# Altium schematic sheet NB3000_chc_video.SchDoc
size A3
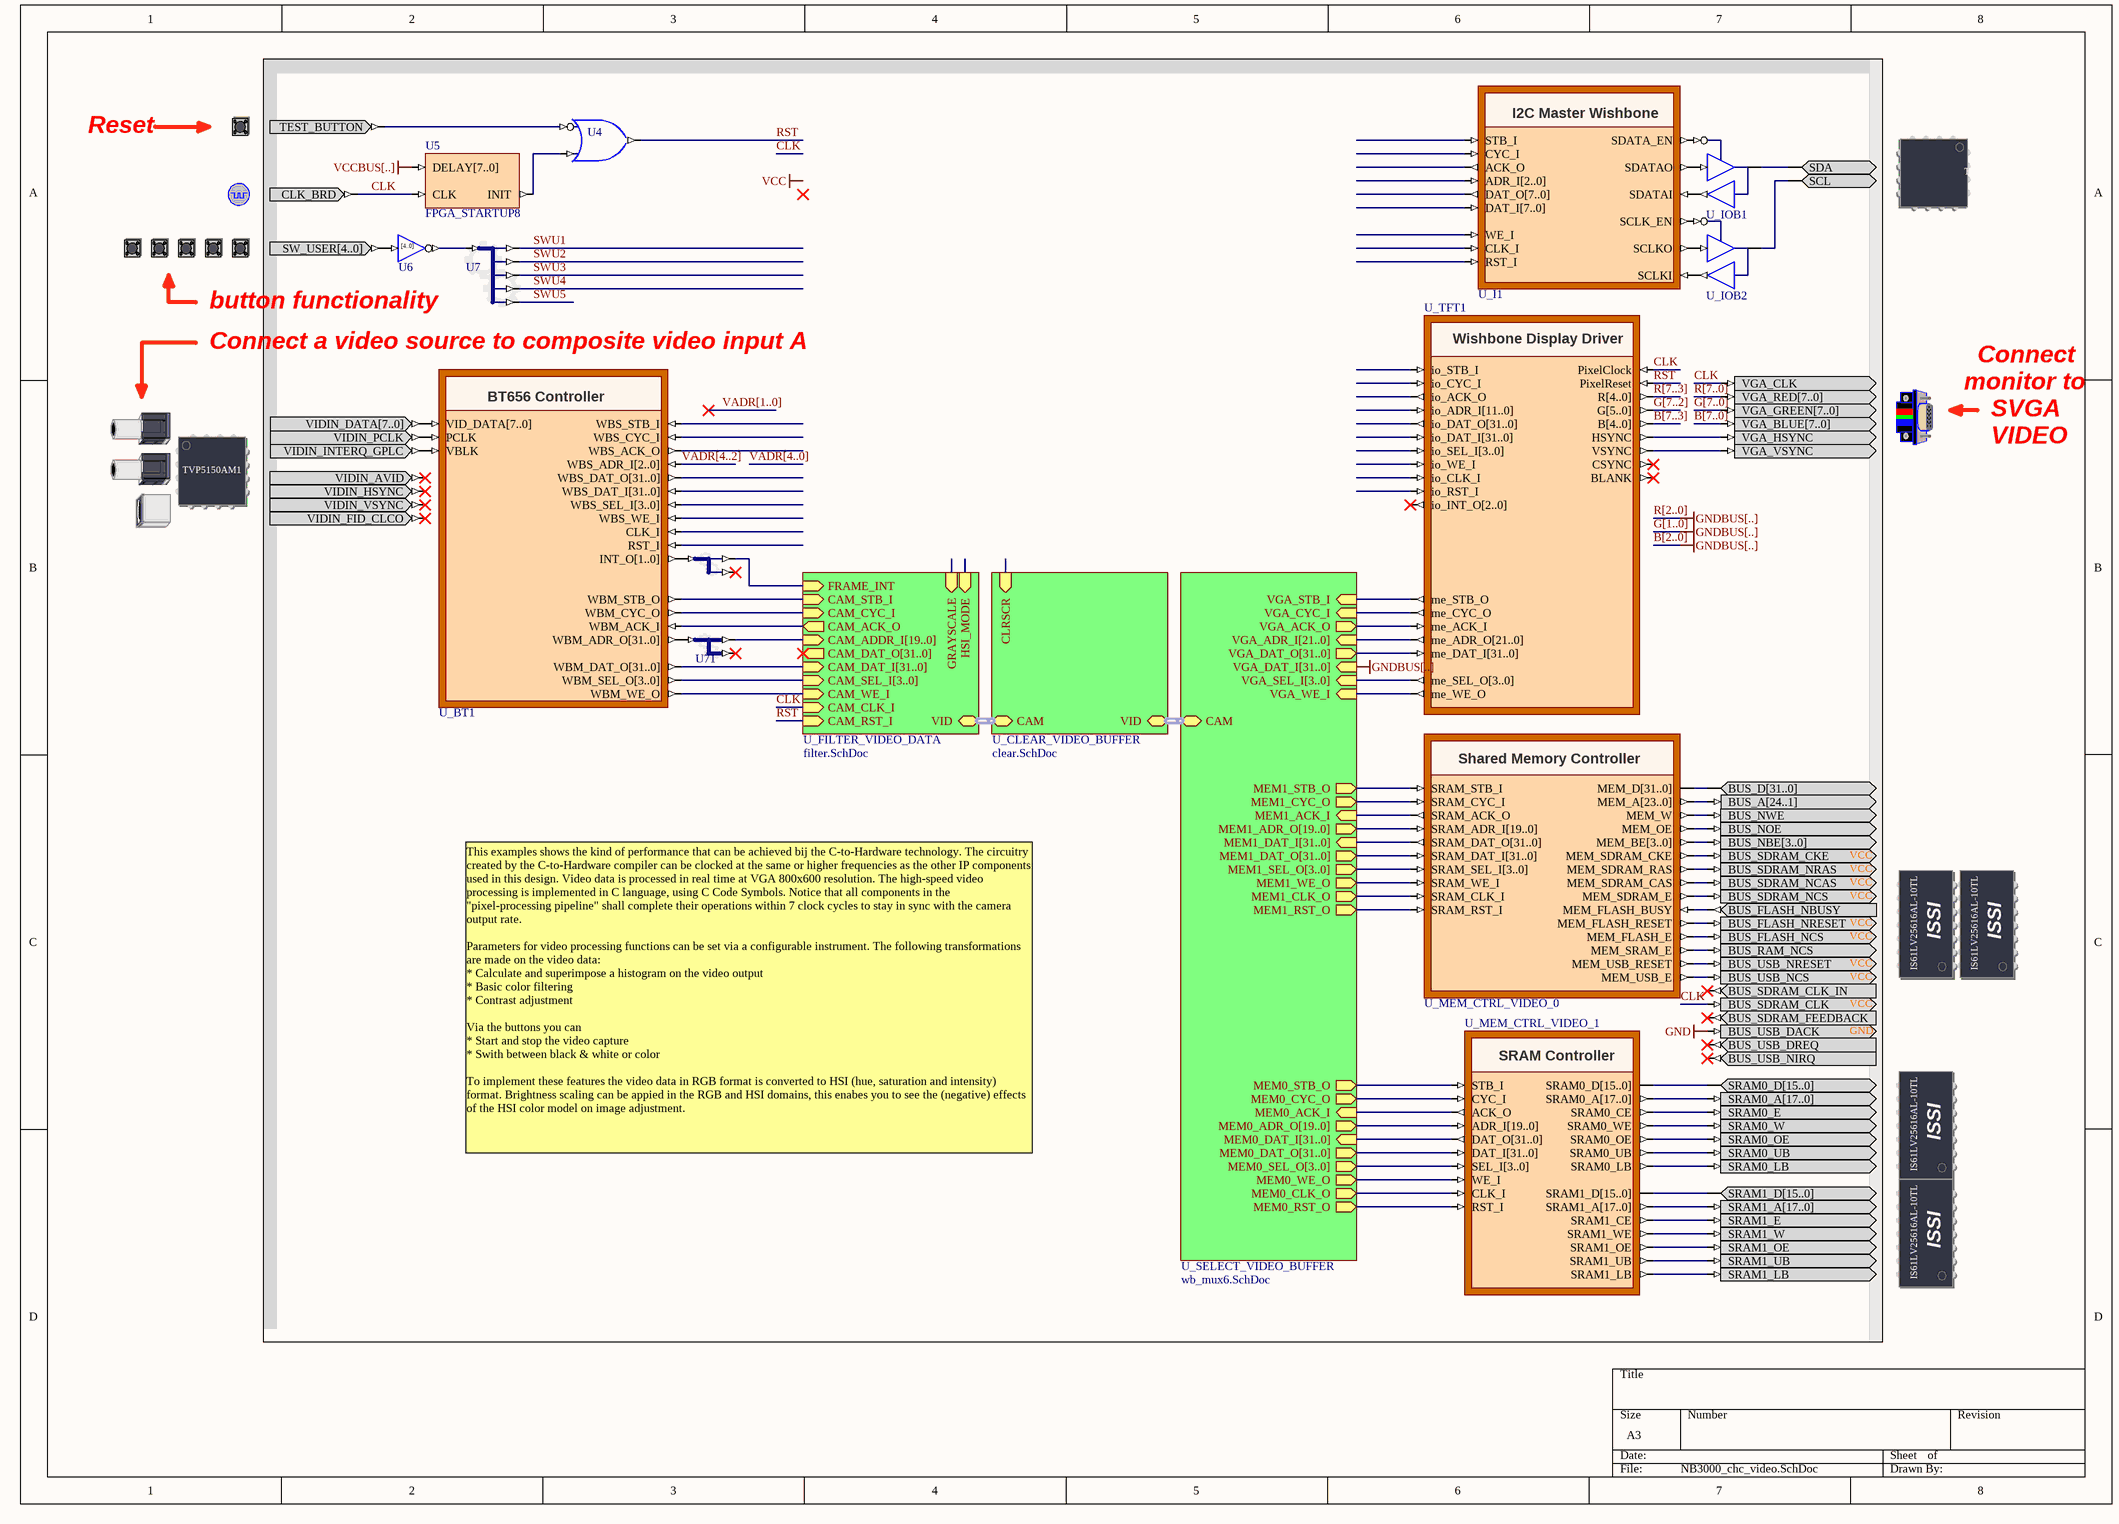
[diagram p0: NB3000_chc_video.SchDoc]

## Parts
(Parts that share a designator on the sheet are numbered #1, #2 ... from top to bottom, then left to right.)
?#1  TEST_BUTTON  (value not drawn)
?#2  VIDEO_INPUT_CTRL  (value not drawn)
?#3  CLOCK_BOARD  (value not drawn)
?#4  USER_BUTTONS  (value not drawn)
?#5  VGACNTR  (value not drawn)
?#6  VIDEO_INPUT  (value not drawn)
?#7  SHARED_SRAM  (value not drawn)
?#8  SRAM0  (value not drawn)
?#9  SRAM1  (value not drawn)
U4  OR2N1S  (value not drawn)
U5  FPGA_STARTUP8
U6  INV5B  (value not drawn)
U7  BUS_JS  (value not drawn)
U45  BUS_JS  (value not drawn)
U71  BUS_JS  (value not drawn)
U_BT1  BT656  (value not drawn)
U_I1  I2CM_W  (value not drawn)
U_IOB1  IOBUF  (value not drawn)
U_IOB2  IOBUF  (value not drawn)
U_MEM_CTRL_VIDEO_0  WB_SHARED_MEM_CTRL_NB3000  (value not drawn)
U_MEM_CTRL_VIDEO_1  WB_MEM_CTRL  (value not drawn)
U_TFT1  WB_VGA  (value not drawn)

## Sub-sheets
U_CLEAR_VIDEO_BUFFER = clear.SchDoc: CAM (harness H_WB), VID (harness H_WB), CLRSCR (in)
U_FILTER_VIDEO_DATA = filter.SchDoc: FRAME_INT (in), HSI_MODE (in), GRAYSCALE (in), CAM_CLK_I (in), CAM_RST_I (in), CAM_STB_I (in), CAM_CYC_I (in), CAM_ACK_O (out), CAM_ADDR_I[19..0] (in), CAM_DAT_I[31..0] (in), CAM_DAT_O[31..0] (out), CAM_SEL_I[3..0] (in), CAM_WE_I (in), VID (harness H_WB)
U_SELECT_VIDEO_BUFFER = wb_mux6.SchDoc: MEM1_STB_O (out), MEM1_CYC_O (out), MEM1_ACK_I (in), MEM1_ADR_O[19..0] (out), MEM1_DAT_I[31..0] (in), MEM1_DAT_O[31..0] (out), MEM1_SEL_O[3..0] (out), MEM1_WE_O (out), MEM1_CLK_O (out), MEM1_RST_O (out), MEM0_STB_O (out), MEM0_CYC_O (out), MEM0_ACK_I (in), MEM0_ADR_O[19..0] (out), MEM0_DAT_I[31..0] (in), MEM0_DAT_O[31..0] (out), MEM0_SEL_O[3..0] (out), MEM0_WE_O (out), MEM0_CLK_O (out), MEM0_RST_O (out), VGA_ADR_I[21..0] (in), VGA_CYC_I (in), VGA_STB_I (in), VGA_WE_I (in), VGA_DAT_I[31..0] (in), VGA_ACK_O (out), VGA_DAT_O[31..0] (out), VGA_SEL_I[3..0] (in), CAM (harness H_WB)

## Nets
GND: ?#7.BUS_USB_DACK
VCCBUS[..]: U5.DELAY[7..0]
B[7..0]: ?#5.VGA_BLUE[7..0]
B[7..3]: U_TFT1.B[4..0]
CLK: ?#3.CLK_BRD ?#5.VGA_CLK ?#7.BUS_SDRAM_CLK U5.CLK U_TFT1.PixelClock ; sheet U_FILTER_VIDEO_DATA/CAM_CLK_I
G[7..0]: ?#5.VGA_GREEN[7..0]
G[7..2]: U_TFT1.G[5..0]
R[7..0]: ?#5.VGA_RED[7..0]
R[7..3]: U_TFT1.R[4..0]
RST: U4.O U_TFT1.PixelReset ; sheet U_FILTER_VIDEO_DATA/CAM_RST_I
SWU1: U7.O0
SWU2: U7.O1
SWU3: U7.O2
SWU4: U7.O3
SWU5: U7.O4
VADR[4..2]: U_BT1.WBS_ADR_I[2..0]
Net?#1_TEST_BUTTON: ?#1.TEST_BUTTON U4.I0
Net?#2_SCL: ?#2.SCL U_IOB2.IO
Net?#2_SDA: ?#2.SDA U_IOB1.IO
Net?#4_SW_USER[4..0]: ?#4.SW_USER[4..0] U6.I[4..0]
Net?#5_VGA_HSYNC: ?#5.VGA_HSYNC U_TFT1.HSYNC
Net?#5_VGA_VSYNC: ?#5.VGA_VSYNC U_TFT1.VSYNC
Net?#6_VIDIN_DATA[7..0]: ?#6.VIDIN_DATA[7..0] U_BT1.VID_DATA[7..0]
Net?#6_VIDIN_INTERQ_GPLC: ?#6.VIDIN_INTERQ_GPLC U_BT1.VBLK
Net?#6_VIDIN_PCLK: ?#6.VIDIN_PCLK U_BT1.PCLK
Net?#7_BUS_A[24..1]: ?#7.BUS_A[24..1] U_MEM_CTRL_VIDEO_0.MEM_A[23..0]
Net?#7_BUS_D[31..0]: ?#7.BUS_D[31..0] U_MEM_CTRL_VIDEO_0.MEM_D[31..0]
Net?#7_BUS_FLASH_NBUSY: ?#7.BUS_FLASH_NBUSY U_MEM_CTRL_VIDEO_0.MEM_FLASH_BUSY
Net?#7_BUS_FLASH_NCS: ?#7.BUS_FLASH_NCS U_MEM_CTRL_VIDEO_0.MEM_FLASH_E
Net?#7_BUS_FLASH_NRESET: ?#7.BUS_FLASH_NRESET U_MEM_CTRL_VIDEO_0.MEM_FLASH_RESET
Net?#7_BUS_NBE[3..0]: ?#7.BUS_NBE[3..0] U_MEM_CTRL_VIDEO_0.MEM_BE[3..0]
Net?#7_BUS_NOE: ?#7.BUS_NOE U_MEM_CTRL_VIDEO_0.MEM_OE
Net?#7_BUS_NWE: ?#7.BUS_NWE U_MEM_CTRL_VIDEO_0.MEM_W
Net?#7_BUS_RAM_NCS: ?#7.BUS_RAM_NCS U_MEM_CTRL_VIDEO_0.MEM_SRAM_E
Net?#7_BUS_SDRAM_CKE: ?#7.BUS_SDRAM_CKE U_MEM_CTRL_VIDEO_0.MEM_SDRAM_CKE
Net?#7_BUS_SDRAM_NCAS: ?#7.BUS_SDRAM_NCAS U_MEM_CTRL_VIDEO_0.MEM_SDRAM_CAS
Net?#7_BUS_SDRAM_NCS: ?#7.BUS_SDRAM_NCS U_MEM_CTRL_VIDEO_0.MEM_SDRAM_E
Net?#7_BUS_SDRAM_NRAS: ?#7.BUS_SDRAM_NRAS U_MEM_CTRL_VIDEO_0.MEM_SDRAM_RAS
Net?#7_BUS_USB_NCS: ?#7.BUS_USB_NCS U_MEM_CTRL_VIDEO_0.MEM_USB_E
Net?#7_BUS_USB_NRESET: ?#7.BUS_USB_NRESET U_MEM_CTRL_VIDEO_0.MEM_USB_RESET
Net?#8_SRAM0_A[17..0]: ?#8.SRAM0_A[17..0] U_MEM_CTRL_VIDEO_1.SRAM0_A[17..0]
Net?#8_SRAM0_D[15..0]: ?#8.SRAM0_D[15..0] U_MEM_CTRL_VIDEO_1.SRAM0_D[15..0]
Net?#8_SRAM0_E: ?#8.SRAM0_E U_MEM_CTRL_VIDEO_1.SRAM0_CE
Net?#8_SRAM0_LB: ?#8.SRAM0_LB U_MEM_CTRL_VIDEO_1.SRAM0_LB
Net?#8_SRAM0_OE: ?#8.SRAM0_OE U_MEM_CTRL_VIDEO_1.SRAM0_OE
Net?#8_SRAM0_UB: ?#8.SRAM0_UB U_MEM_CTRL_VIDEO_1.SRAM0_UB
Net?#8_SRAM0_W: ?#8.SRAM0_W U_MEM_CTRL_VIDEO_1.SRAM0_WE
Net?#9_SRAM1_A[17..0]: ?#9.SRAM1_A[17..0] U_MEM_CTRL_VIDEO_1.SRAM1_A[17..0]
Net?#9_SRAM1_D[15..0]: ?#9.SRAM1_D[15..0] U_MEM_CTRL_VIDEO_1.SRAM1_D[15..0]
Net?#9_SRAM1_E: ?#9.SRAM1_E U_MEM_CTRL_VIDEO_1.SRAM1_CE
Net?#9_SRAM1_LB: ?#9.SRAM1_LB U_MEM_CTRL_VIDEO_1.SRAM1_LB
Net?#9_SRAM1_OE: ?#9.SRAM1_OE U_MEM_CTRL_VIDEO_1.SRAM1_OE
Net?#9_SRAM1_UB: ?#9.SRAM1_UB U_MEM_CTRL_VIDEO_1.SRAM1_UB
Net?#9_SRAM1_W: ?#9.SRAM1_W U_MEM_CTRL_VIDEO_1.SRAM1_WE
NetU4_I1: U4.I1 U5.INIT
NetU6_O[4..0]: U6.O[4..0] U7.I[4..0]
NetU45_I[1..0]: U45.I[1..0] U_BT1.INT_O[1..0]
NetU45_O0: U45.O0 ; sheet U_FILTER_VIDEO_DATA/FRAME_INT
NetU71_I[31..0]: U71.I[31..0] U_BT1.WBM_ADR_O[31..0]
NetU71_O0_B[19..0]: U71.O0_B[19..0] ; sheet U_FILTER_VIDEO_DATA/CAM_ADDR_I[19..0]
NetU_BT1_WBM_ACK_I: U_BT1.WBM_ACK_I ; sheet U_FILTER_VIDEO_DATA/CAM_ACK_O
NetU_BT1_WBM_CYC_O: U_BT1.WBM_CYC_O ; sheet U_FILTER_VIDEO_DATA/CAM_CYC_I
NetU_BT1_WBM_DAT_O[31..0]: U_BT1.WBM_DAT_O[31..0] ; sheet U_FILTER_VIDEO_DATA/CAM_DAT_I[31..0]
NetU_BT1_WBM_SEL_O[3..0]: U_BT1.WBM_SEL_O[3..0] ; sheet U_FILTER_VIDEO_DATA/CAM_SEL_I[3..0]
NetU_BT1_WBM_STB_O: U_BT1.WBM_STB_O ; sheet U_FILTER_VIDEO_DATA/CAM_STB_I
NetU_BT1_WBM_WE_O: U_BT1.WBM_WE_O ; sheet U_FILTER_VIDEO_DATA/CAM_WE_I
NetU_I1_SCLK_EN: U_I1.SCLK_EN U_IOB2.T
NetU_I1_SCLKI: U_I1.SCLKI U_IOB2.O
NetU_I1_SCLKO: U_I1.SCLKO U_IOB2.I
NetU_I1_SDATA_EN: U_I1.SDATA_EN U_IOB1.T
NetU_I1_SDATAI: U_I1.SDATAI U_IOB1.O
NetU_I1_SDATAO: U_I1.SDATAO U_IOB1.I
NetU_MEM_CTRL_VIDEO_0_SRAM_ACK_O: U_MEM_CTRL_VIDEO_0.SRAM_ACK_O ; sheet U_SELECT_VIDEO_BUFFER/MEM1_ACK_I
NetU_MEM_CTRL_VIDEO_0_SRAM_ADR_I[19..0]: U_MEM_CTRL_VIDEO_0.SRAM_ADR_I[19..0] ; sheet U_SELECT_VIDEO_BUFFER/MEM1_ADR_O[19..0]
NetU_MEM_CTRL_VIDEO_0_SRAM_CLK_I: U_MEM_CTRL_VIDEO_0.SRAM_CLK_I ; sheet U_SELECT_VIDEO_BUFFER/MEM1_CLK_O
NetU_MEM_CTRL_VIDEO_0_SRAM_CYC_I: U_MEM_CTRL_VIDEO_0.SRAM_CYC_I ; sheet U_SELECT_VIDEO_BUFFER/MEM1_CYC_O
NetU_MEM_CTRL_VIDEO_0_SRAM_DAT_I[31..0]: U_MEM_CTRL_VIDEO_0.SRAM_DAT_I[31..0] ; sheet U_SELECT_VIDEO_BUFFER/MEM1_DAT_O[31..0]
NetU_MEM_CTRL_VIDEO_0_SRAM_DAT_O[31..0]: U_MEM_CTRL_VIDEO_0.SRAM_DAT_O[31..0] ; sheet U_SELECT_VIDEO_BUFFER/MEM1_DAT_I[31..0]
NetU_MEM_CTRL_VIDEO_0_SRAM_RST_I: U_MEM_CTRL_VIDEO_0.SRAM_RST_I ; sheet U_SELECT_VIDEO_BUFFER/MEM1_RST_O
NetU_MEM_CTRL_VIDEO_0_SRAM_SEL_I[3..0]: U_MEM_CTRL_VIDEO_0.SRAM_SEL_I[3..0] ; sheet U_SELECT_VIDEO_BUFFER/MEM1_SEL_O[3..0]
NetU_MEM_CTRL_VIDEO_0_SRAM_STB_I: U_MEM_CTRL_VIDEO_0.SRAM_STB_I ; sheet U_SELECT_VIDEO_BUFFER/MEM1_STB_O
NetU_MEM_CTRL_VIDEO_0_SRAM_WE_I: U_MEM_CTRL_VIDEO_0.SRAM_WE_I ; sheet U_SELECT_VIDEO_BUFFER/MEM1_WE_O
NetU_MEM_CTRL_VIDEO_1_ACK_O: U_MEM_CTRL_VIDEO_1.ACK_O ; sheet U_SELECT_VIDEO_BUFFER/MEM0_ACK_I
NetU_MEM_CTRL_VIDEO_1_ADR_I[19..0]: U_MEM_CTRL_VIDEO_1.ADR_I[19..0] ; sheet U_SELECT_VIDEO_BUFFER/MEM0_ADR_O[19..0]
NetU_MEM_CTRL_VIDEO_1_CLK_I: U_MEM_CTRL_VIDEO_1.CLK_I ; sheet U_SELECT_VIDEO_BUFFER/MEM0_CLK_O
NetU_MEM_CTRL_VIDEO_1_CYC_I: U_MEM_CTRL_VIDEO_1.CYC_I ; sheet U_SELECT_VIDEO_BUFFER/MEM0_CYC_O
NetU_MEM_CTRL_VIDEO_1_DAT_I[31..0]: U_MEM_CTRL_VIDEO_1.DAT_I[31..0] ; sheet U_SELECT_VIDEO_BUFFER/MEM0_DAT_O[31..0]
NetU_MEM_CTRL_VIDEO_1_DAT_O[31..0]: U_MEM_CTRL_VIDEO_1.DAT_O[31..0] ; sheet U_SELECT_VIDEO_BUFFER/MEM0_DAT_I[31..0]
NetU_MEM_CTRL_VIDEO_1_RST_I: U_MEM_CTRL_VIDEO_1.RST_I ; sheet U_SELECT_VIDEO_BUFFER/MEM0_RST_O
NetU_MEM_CTRL_VIDEO_1_SEL_I[3..0]: U_MEM_CTRL_VIDEO_1.SEL_I[3..0] ; sheet U_SELECT_VIDEO_BUFFER/MEM0_SEL_O[3..0]
NetU_MEM_CTRL_VIDEO_1_STB_I: U_MEM_CTRL_VIDEO_1.STB_I ; sheet U_SELECT_VIDEO_BUFFER/MEM0_STB_O
NetU_MEM_CTRL_VIDEO_1_WE_I: U_MEM_CTRL_VIDEO_1.WE_I ; sheet U_SELECT_VIDEO_BUFFER/MEM0_WE_O
NetU_TFT1_me_ACK_I: U_TFT1.me_ACK_I ; sheet U_SELECT_VIDEO_BUFFER/VGA_ACK_O
NetU_TFT1_me_ADR_O[21..0]: U_TFT1.me_ADR_O[21..0] ; sheet U_SELECT_VIDEO_BUFFER/VGA_ADR_I[21..0]
NetU_TFT1_me_CYC_O: U_TFT1.me_CYC_O ; sheet U_SELECT_VIDEO_BUFFER/VGA_CYC_I
NetU_TFT1_me_DAT_I[31..0]: U_TFT1.me_DAT_I[31..0] ; sheet U_SELECT_VIDEO_BUFFER/VGA_DAT_O[31..0]
NetU_TFT1_me_SEL_O[3..0]: U_TFT1.me_SEL_O[3..0] ; sheet U_SELECT_VIDEO_BUFFER/VGA_SEL_I[3..0]
NetU_TFT1_me_STB_O: U_TFT1.me_STB_O ; sheet U_SELECT_VIDEO_BUFFER/VGA_STB_I
NetU_TFT1_me_WE_O: U_TFT1.me_WE_O ; sheet U_SELECT_VIDEO_BUFFER/VGA_WE_I

Not connected (* = marked no-connect by the designer): ?#6 VIDIN_AVID* VIDIN_FID_CLCO* VIDIN_HSYNC* VIDIN_VSYNC*; ?#7 BUS_SDRAM_CLK_IN* BUS_SDRAM_FEEDBACK* BUS_USB_DREQ* BUS_USB_NIRQ*; U45 O1*; U71 O1_B[11..0]*; U_BT1 CLK_I RST_I WBS_ACK_O WBS_CYC_I WBS_DAT_I[31..0] WBS_DAT_O[31..0] WBS_SEL_I[3..0] WBS_STB_I WBS_WE_I; U_I1 ACK_O ADR_I[2..0] CLK_I CYC_I DAT_I[7..0] DAT_O[7..0] INT_O RST_I STB_I WE_I; U_TFT1 BLANK* CSYNC* io_ACK_O io_ADR_I[11..0] io_CLK_I io_CYC_I io_DAT_I[31..0] io_DAT_O[31..0] io_INT_O[2..0]* io_RST_I io_SEL_I[3..0] io_STB_I io_WE_I

## Buses and harness runs
bus B[2..0]
bus B[7..0]
bus B[7..3]
bus G[1..0]
bus G[7..0]
bus G[7..2]
bus R[2..0]
bus R[7..0]
bus R[7..3]
bus VADR[1..0]
bus VADR[4..0]
bus VADR[4..2]
harness sheet U_CLEAR_VIDEO_BUFFER/CAM = sheet U_FILTER_VIDEO_DATA/VID
harness sheet U_CLEAR_VIDEO_BUFFER/VID = sheet U_SELECT_VIDEO_BUFFER/CAM

## Notes on the sheet
- Reset
- button functionality
- (near U7) Connect a video source to composite video input A
- Connect
- monitor to
- SVGA
- VIDEO
- This examples shows the kind of performance that can be achieved bij the C-to-Hardware technology. The circuitry created by the C-to-Hardware compiler can be clocked at the same or higher frequencies as the other IP components used in this design. Video data is processed in real time at VGA 800x600 resolution. The high-speed video processing is implemented in C language, using C Code Symbols. Notice that all components in the "pixel-processing pipeline" shall complete their operations within 7 clock cycles to stay in sync with the camera output rate.
  Parameters for video processing functions can be set via a configurable instrument. The following transformations are made on the video data:
  * Calculate and superimpose a histogram on the video output
  * Basic color filtering
  * Contrast adjustment
  Via the buttons you can
  * Start and stop the video capture
  * Swith between black & white or color
  To implement these features the video data in RGB format is converted to HSI (hue, saturation and intensity) format. Brightness scaling can be appied in the RGB and HSI domains, this enabes you to see the (negative) effects of the HSI color model on image adjustment.
- Labels drawn without touching a wire or pin: VCC
- (in symbol BT656) BT656 Controller
- (in symbol INV5B) [4..0]
- (in symbol SHARED_SRAM) VCC; ISSI; IS61LV25616AL-10TL; GND
- (in symbol SRAM0) ISSI; IS61LV25616AL-10TL
- (in symbol SRAM1) ISSI; IS61LV25616AL-10TL
- (in symbol VIDEO_INPUT) TVP5150AM1
- (in symbol VIDEO_INPUT_CTRL) TVP5150AM1
- (in symbol WB_MEM_CTRL) SRAM Controller
- (in symbol WB_SHARED_MEM_CTRL_NB3000) Shared Memory Controller

## Library data of the parts
?#1 = TEST_BUTTON: Test / Reset Button; PortComponent: True; Published: 19-Nov-2003; Publisher: Altium Limited; HelpURL: https://wiki.altium.com/display/ADOH/NanoBoard+3000+-+Test-Reset+Button
?#2 = VIDEO_INPUT_CTRL: Video Input Control; PortComponent: True; Published: 22-Jan-2007; Publisher: Altium Limited; HelpURL: https://wiki.altium.com/display/ADOH/PB01+Resources+-+Video+Input+Capture
?#3 = CLOCK_BOARD: Global System Clock Supply; PortComponent: True; Published: 19-Nov-2003; Publisher: Altium Limited; HelpURL: https://wiki.altium.com/display/ADOH/NanoBoard+3000+-+System+Clocks; UseInDSF: True
?#4 = USER_BUTTONS: Generic User Buttons; PortComponent: True; Published: 16-Apr-2007; Publisher: Altium Limited; HelpURL: https://wiki.altium.com/display/ADOH/NanoBoard+3000+-+Generic+User+Switches
?#5 = VGACNTR: VGA Dsub-15-Female-HD; PortComponent: True; Published: 14-May-2007; Publisher: Altium Limited; HelpURL: https://wiki.altium.com/display/ADOH/NanoBoard+3000+-+Video+Output
?#6 = VIDEO_INPUT: Video Inputs; PortComponent: True; Published: 22-Jan-2007; Publisher: Altium Limited; HelpURL: https://wiki.altium.com/display/ADOH/PB01+Resources+-+Video+Input+Capture
?#7 = SHARED_SRAM: Common-Bus SRAM; PortComponent: True; Published: 14-May-2007; Publisher: Altium Limited; HelpURL: https://wiki.altium.com/display/ADOH/Accessing+Common-Bus+Resources+on+the+NanoBoard+3000
?#8 = SRAM0: Free Static RAM - Daughterboard; PortComponent: True; Published: 14-May-2007; Publisher: Altium Limited; HelpURL: https://wiki.altium.com/display/ADOH/NanoBoard+3000+-+Independent+SRAM
?#9 = SRAM1: Free Static RAM - Daughterboard; PortComponent: True; Published: 14-May-2007; Publisher: Altium Limited; HelpURL: https://wiki.altium.com/display/ADOH/NanoBoard+3000+-+Independent+SRAM
U4 = OR2N1S: 2-Input OR Gate with Active Low A Input, Single Pin Version; XilinxEquivalent: OR2B1; FunctionalClass: Logic Primitive; PortSize: 2; ArchiveName: GENERIC; VHDLIB_SIM: GENERIC_LIB; Published: 29-Jan-2004; Publisher: Altium Limited; LastRevisionNo: 1.00.00; HelpURL: CR0118 FPGA Generic Library Guide.pdf#page=410; ComponentLink1URL: CR0136 FPGA Logic Primitive Resource Usage.pdf#page=187; ComponentLink1Description: Core &Resource Usage; SubClass: OR; PortStyle: Single Pin Version
U5 = FPGA_STARTUP8: FPGA Startup With 8 Bit Delay; Published: 9-Dec-2004; Publisher: Altium Limited; HelpURL: CR0119 FPGA_STARTUPx Powerup Delay Unit.pdf; LastRevisionNo: 1.00.00; ComponentLink1Description: Core &Resource Usage; ComponentLink1URL: CR0139 FPGA Peripheral Resource Usage.pdf#page=11
U6 = INV5B: 5-Bit Inverter, Bus Version; FunctionalClass: Logic Primitive; SubClass: INV; PortSize: 5; ArchiveName: GENERIC; VHDLIB_SIM: GENERIC_LIB; Published: 29-Jan-2004; Publisher: Altium Limited; LastRevisionNo: 1.00.00; HelpURL: CR0118 FPGA Generic Library Guide.pdf#page=291; ComponentLink1URL: CR0136 FPGA Logic Primitive Resource Usage.pdf#page=68; ComponentLink1Description: Core &Resource Usage; PortStyle: Bus Version
U7 = BUS_JS: Configurable Bus Joiner/Splitter; ConfiguratorName: GENERIC_BUS_JS; ConfigurationParameters: {}Version[1.1]{}SplitterJoinerType[Splitter]{}SignalCount[5]{}SignalWidth0[1]{}GapBelow0[1000000]{}ConnectionType0[Pin]{}SignalWidth1[1]{}GapBelow1[1000000]{}ConnectionType1[Pin]{}SignalWidth2[1]{}GapBelow2[1000000]{}ConnectionType2[Pin]{}SignalWidth3[1]{}GapBelow3[1000000]{}ConnectionType3[Pin]{}SignalWidth4[1]{}GapBelow4[1000000]{}ConnectionType4[Pin]{}ShowPinNames[False]{}; LastRevisionNo: 1.00.00; Published: 17-Sep-2008; Publisher: Altium Limited
U45 = BUS_JS: Configurable Bus Joiner/Splitter; ConfiguratorName: GENERIC_BUS_JS; ConfigurationParameters: {}Version[1.1]{}SplitterJoinerType[Splitter]{}SignalCount[2]{}SignalWidth0[1]{}GapBelow0[1000000]{}ConnectionType0[Pin]{}SignalWidth1[1]{}GapBelow1[1000000]{}ConnectionType1[Pin]{}ShowPinNames[False]{}; LastRevisionNo: 1.00.00; Published: 17-Sep-2008; Publisher: Altium Limited; HelpURL: https://wiki.altium.com/display/ADOH/Configurable+Generic+Library
U71 = BUS_JS: Configurable Bus Joiner/Splitter; ConfiguratorName: GENERIC_BUS_JS; ConfigurationParameters: {}Version[1.1]{}SplitterJoinerType[Splitter]{}SignalCount[2]{}SignalWidth0[20]{}GapBelow0[1000000]{}ConnectionType0[Pin]{}SignalWidth1[12]{}GapBelow1[1000000]{}ConnectionType1[Pin]{}ShowPinNames[False]{}; LastRevisionNo: 1.00.00; Published: 17-Sep-2008; Publisher: Altium Limited
U_BT1 = BT656: Wishbone BT656 Controller; UseInDSF: True; ComponentLink1Description: Core &Resource Usage; ComponentLink1URL: CR0139 FPGA Peripheral Resource Usage.pdf#page=2; HelpURL: CR0159 BT656 Video Capture Controller.pdf; LastRevisionNo: 1.00.00; Published: 27-Mar-2005; Publisher: Altium Limited
U_I1 = WB_I2CM: I2C Master Wishbone; UseInDSF: True; Published: 9-Dec-2004; Publisher: Altium Limited; ComponentLink1Description: Core &Resource Usage; ComponentLink1URL: CR0139 FPGA Peripheral Resource Usage.pdf#page=17; HelpURL: CR0105 I2CM Controller.pdf; LastRevisionNo: 1.00.00
U_IOB1 U_IOB2 = IOBUF: Input/Output Buffer; Enable: Low; Control: Common Control T; ArchiveName: GENERIC; VHDLIB_SIM: GENERIC_LIB; Published: 29-Jan-2004; Publisher: Altium Limited; XilinxEquivalent: IOBUF; LastRevisionNo: 1.00.00; HelpURL: CR0118 FPGA Generic Library Guide.pdf#page=293; ComponentLink1URL: CR0125 FPGA Buffer Resource Usage.pdf#page=78; ComponentLink1Description: Core &Resource Usage; FunctionalClass: Buffer; SubClass: IOBUF
U_MEM_CTRL_VIDEO_0 = WB_SHARED_MEM_CTRL_NB3000: Configurable Shared Memory Controller; ConfigurationParameters: {}Version[2.0]{}SRAMOption_MemoryEnabled[True]{}SRAMOption_ClockScheme[0]{}SRAMOption_MemorySize[10]{}SRAMOption_MemoryLayout[0]{}SRAMOption_GuiPortLayout[0]{}SRAMOption_GuiExtraSpace[4]{}SRAMOption_AddressSetup[1]{}SRAMOption_WritePulse[1]{}SRAMOption_WriteHold[1]{}FLASHOption_MemoryEnabled[False]{}FLASHOption_ClockScheme[0]{}FLASHOption_MemorySize[0]{}FLASHOption_MemoryLayout[0]{}FLASHOption_GuiPortLayout[2]{}FLASHOption_GuiExtraSpace[4]{}FLASHOption_AddressSetup[6]{}FLASHOption_WritePulse[6]{}FLASHOption_WriteHold[6]{}SDRAMOption_MemoryEnabled[False]{}SDRAMOption_ClockScheme[0]{}SDRAMOption_MemorySize[3]{}SDRAMOption_MemoryLayout[3]{}SDRAMOption_GuiPortLayout[1]{}SDRAMOption_GuiExtraSpace[4]{}SDRAMOption_Frequency[100]{}SDRAMOption_RefreshInterval[1]{}SDRAMOption_RefreshPrescaler[145]{}SDRAMOption_BusWidth[1]{}SDRAMOption_BusMode[1]{}SDRAMOption_BusType[0]{}SDRAMOption_BurstLength[0]{}SDRAMOption_Timing_tCL[3]{}SDRAMOption_Timing_tMRD[2]{}SDRAMOption_Timing_tRCD[2]{}SDRAMOption_Timing_tRFC[2]{}SDRAMOption_Timing_tRP[2]{}SDRAMOption_Timing_tWR[2]{}SDRAMOption_KeepRowOpen[True]{}SDRAMOption_IsCached[True]{}SDRAMOption_RefreshRate[0]{}USBOption_MemoryEnabled[False]{}USBOption_ClockScheme[0]{}USBOption_MemorySize[0]{}USBOption_MemoryLayout[0]{}USBOption_GuiPortLayout[3]{}USBOption_GuiExtraSpace[4]{}USBOption_AddressSetup[2]{}USBOption_WritePulse[2]{}USBOption_WriteHold[2]{}Option_DisableUnusedPins[False]{}Option_LastView[1]{}Option_ComponentVersion[3]{}; ChildModel: WB_SDRAM_256x32; ComponentLink1Description: Core &Resource Usage; ComponentLink1URL: CR0139 FPGA Peripheral Resource Usage.pdf; LastRevisionNo: 1.00.00; Published: 20-Apr-2009; Publisher: Altium Limited; ConfiguratorName: SHARED_MEM_CTRL
U_MEM_CTRL_VIDEO_1 = WB_MEM_CTRL: Configurable Memory Controller; ConfigurationParameters: {}Version[1.0]{}Option_MemoryType[Asynchronous SRAM]{}Option_MemorySize[1 MB (256K x 32-bit)]{}Option_Layout[2 x 16-bit Wide Devices]{}Option_Read[2]{}Option_WriteSetup[1]{}Option_WritePulse[1]{}Option_WriteHold[1]{}Option_FlashRead[4]{}Option_FlashWriteSetup[1]{}Option_FlashWritePulse[5]{}Option_FlashWriteHold[1]{}Option_SdramKeepRowOpen[0]{}Option_SdramClock[100]{}Option_SdramWriteRecovery[4]{}Option_SdramAutoRefresh[16]{}Option_SdramActiveToReadWrite[8]{}Option_SdramPrecharge[16]{}Option_SdramCasLatency[2]{}Option_SdramClockScheme[0]{}; UseInDSF: True; ComponentLink1Description: Core &Resource Usage; ComponentLink1URL: CR0139 FPGA Peripheral Resource Usage.pdf#page=85; HelpURL: CR0152 WB_MEM_CTRL Configurable Wishbone Memory Controller.pdf; LastRevisionNo: 1.00.00; Published: 9-Dec-2004; Publisher: Altium Limited; ConfiguratorName: WB_MEM_CTRL
U_TFT1 = VGA32_16BPP: Wishbone Display Driver; UseInDSF: True; ConfigurationParameters: {}Version[1.0]{}VgaKind[VGA32_16BPP]{}Orientation[Left]{}ExtraSpace[6]{}AddressWidth[22]{}; ConfiguratorName: WB_VGA; ComponentLink1Description: Core &Resource Usage; ComponentLink1URL: CR0139 FPGA Peripheral Resource Usage.pdf#page=46; HelpURL: CR0167 WB_VGA Configurable Wishbone Display Driver.pdf; LastRevisionNo: 1.00.00; Published: 27-Mar-2005; Publisher: Altium Limited